# EAGLE design PowerAdd (EAGLE 7.5.0)
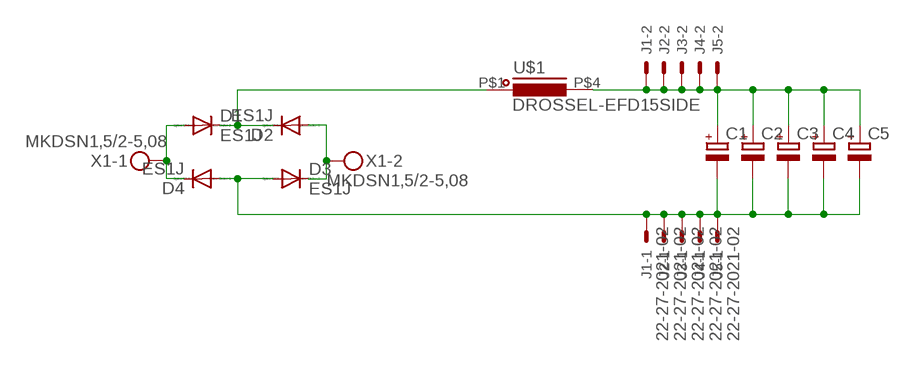
[diagram p0: schematic, sheet 1]

## Parts
C1  CPOL-EUE2.5-6  [E2,5-6]
C2  CPOL-EUE2.5-6  [E2,5-6]
C3  CPOL-EUE2.5-6  [E2,5-6]
C4  CPOL-EUE2.5-6  [E2,5-6]
C5  CPOL-EUE2.5-6  [E2,5-6]
D1  ES1J  DIODE-DO214AC  [DO214AC]
D2  ES1J  DIODE-DO214AC  [DO214AC]
D3  ES1J  DIODE-DO214AC  [DO214AC]
D4  ES1J  DIODE-DO214AC  [DO214AC]
J1  22-27-2021-02  [6410-02]
J2  22-27-2021-02  [6410-02]
J3  22-27-2021-02  [6410-02]
J4  22-27-2021-02  [6410-02]
J5  22-27-2021-02  [6410-02]
U$1  DROSSEL-EFD15SIDE  [EFD15-4PIN]
X1  MKDSN1,5/2-5,08  [MKDSN1,5/2-5,08]

## Nets
N$1: C1.+ C2.+ C3.+ C4.+ C5.+ J1.2 J2.2 J3.2 J4.2 J5.2 U$1.P$4
N$31: D1.C D2.C U$1.P$1
N$32: C1.- C2.- C3.- C4.- C5.- D3.A D4.A J1.1 J2.1 J3.1 J4.1 J5.1
N$33: D2.A D3.C X1.2
N$34: D1.A D4.C X1.1

## Library data of the parts
C1-C5 = rcl:CPOL-EU: POLARIZED CAPACITOR, European symbol
D1-D4 = diode:DIODE-: DIODE
J1-J5 = con-molex:22-?-02: CONNECTOR wire to board 2.54 mm (.1 inch) pitch header; OC_FARNELL: unknown; OC_NEWARK: unknown
U$1 = _Transformers:DROSSEL-EFD15
X1 = con-phoenix-508:MKDSN1,5/2-5,08: MKDSN 1,5/ 2-5,08 Printklemme Nennstrom: 13,5 A Nennspannung: 250 V Rastermaß: 5,08 mm Polzahl: 2 Anschlussart: Schraubanschluss Montage: Löten Anschlussrichtung Leiter/Platine: 0 ° Artikelnummer: 1729128 Source: http://eshop.phoenixcontact.com .. 1729128.pdf

## Board
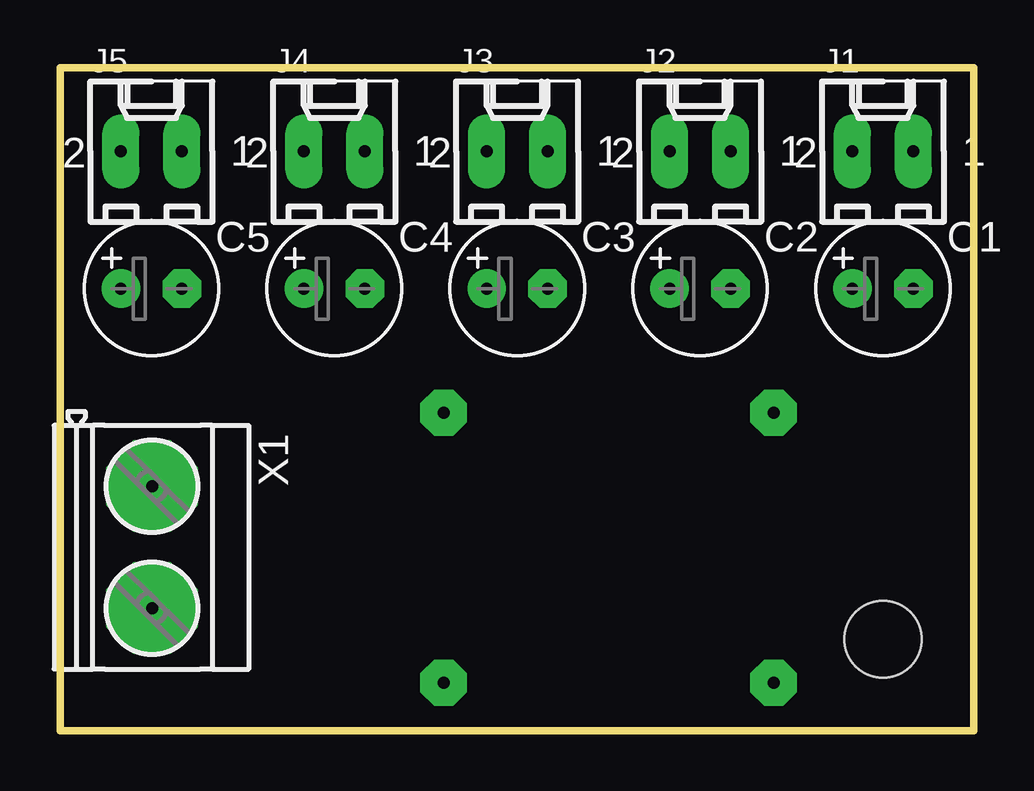
[diagram p1: board, top side]
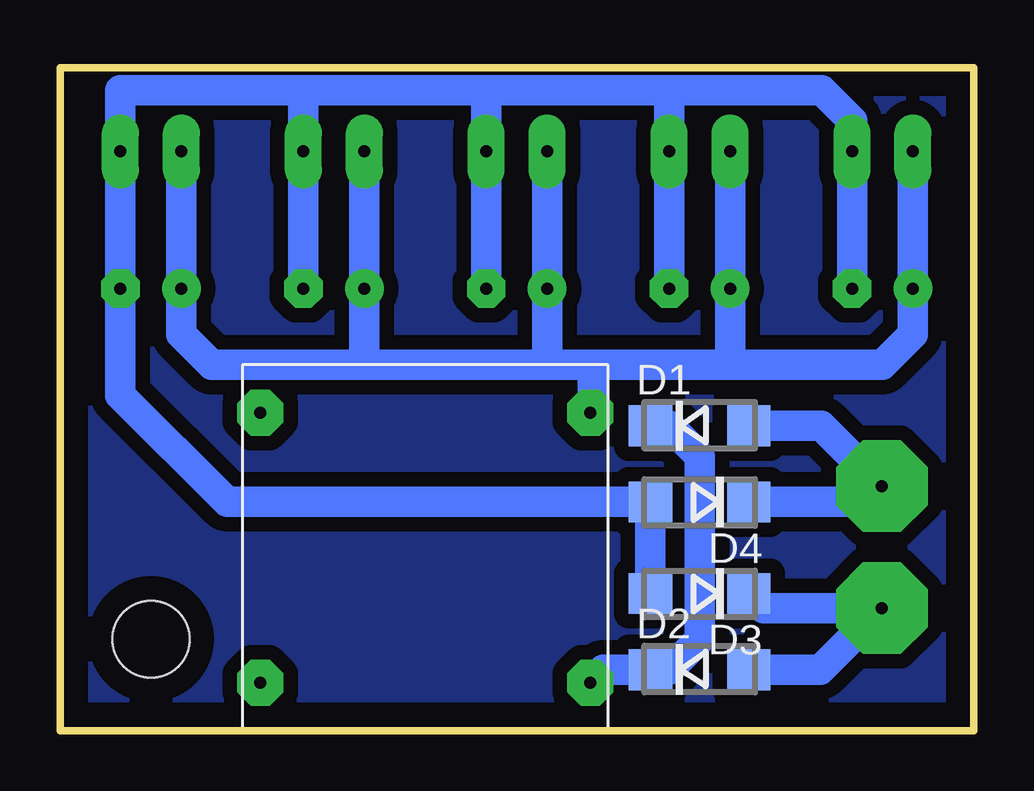
[diagram p2: board, bottom side, seen from below]

Size 38.08 x 27.61 mm. Coordinates in mm from the lower left corner, seen from the top.
Outline: 0,0 38.08,0 38.08,27.61 0,27.61 0,0
Copper layers (1*16): Top 0.035mm / dielectric 1.5mm / Bottom 0.035mm
Design rules "default": minimum track width 10mil, minimum drill 24mil, track to track 8mil, track to pad 8mil, pad to pad 8mil, via to via 8mil, smd to smd 8mil, copper to edge 40mil, drill to drill 8mil, minimum pad ring 10mil, minimum via ring 8mil, stop-mask expansion 4mil, vias tented up to drill 0mil, thermal gap 10mil
Holes 3.2 mm at 34.29,3.81

### Footprints (pad centres in the part's own frame; a part is rotated, then mirrored left to right if it is on the bottom)
E2,5-6 = drill 0.5 pad 1.6: + -1.27,0 | drill 0.5 pad 1.6 octagon: - 1.27,0
DO214AC = smd 1.8 x 1.7: A 2.05,0; C -2.05,0
6410-02 = drill 0.5 pad 1.55 long: 1 1.27,0; 2 -1.27,0
EFD15-4PIN = drill 0.5 pad 1.93 octagon: P$1 -6.875,5.625; P$4 -6.875,-5.625; P$5 6.875,-5.625; P$8 6.875,5.625
MKDSN1,5/2-5,08 = drill 0.5 pad 3.81 octagon: 1 -2.561,0.025; 2 2.519,0.025

### Placement (x,y rotation side)
C1  34.29,18.41 0 top
C2  26.67,18.41 0 top
C3  19.05,18.41 0 top
C4  11.43,18.41 0 top
C5  3.81,18.41 0 top
D1  11.43,12.7 0 bottom
D2  11.43,2.54 0 bottom
D3  11.43,5.71 180 bottom
D4  11.43,9.53 180 bottom
J1  34.29,24.13 0 top
J2  26.67,24.13 0 top
J3  19.05,24.13 0 top
J4  11.43,24.13 0 top
J5  3.81,24.13 0 top
U$1  22.86,7.62 180 bottom
X1  3.81,7.62 270 top

### Tracks (layer width: path | path; a pad name or v marks a point on that pad's centre or on a via)
N$1
  Bottom 1.27: U$1.P$4 15.88,13.36 15.88,15.24 | 15.88,15.24 10.16,15.24 | 10.16,15.24 6.35,15.24 3.81,15.24 2.54,16.51 C5.+ J5.2 | 10.16,15.24 C4.+ J4.2 | 25.4,15.24 31.75,15.24 33.02,16.51 C1.+ J1.2 | 25.4,15.24 17.78,15.24 | 17.78,15.24 15.88,15.24 | 17.78,15.24 C3.+ J3.2 | 25.4,15.24 C2.+ J2.2
N$2
  pour Bottom (isolate 0.61): 0,27.94 38.1,27.94 38.1,0 0,0
N$31
  Bottom 1.27: D2.C 13.97,2.54 | D1.C 12.7,12.7 11.43,11.43 11.43,3.81 12.7,2.54 13.97,2.54 | U$1.P$1 15.44,2.54 13.97,2.54
N$32
  Bottom 1.27: D3.A D4.A 31.11,9.53 35.56,13.97 C1.- J1.1 35.56,26.67 27.94,26.67 | 12.7,26.67 6.35,26.67 5.08,25.4 J5.1 C5.- | 12.7,26.67 20.32,26.67 | 20.32,26.67 27.94,26.67 | 12.7,26.67 J4.1 C4.- | 20.32,26.67 J3.1 C3.- | 27.94,26.67 J2.1 C2.-
N$33
  Bottom 1.27: D2.A 6.4,2.54 X1.2 8.77,5.1 D3.C
N$34
  Bottom 1.27: D4.C 4.49,9.53 X1.1 6.35,12.7 D1.A